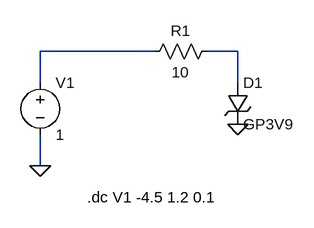
[diagram p0: schematic simulacion_zenner.asc]
simulacion_zenner.asc, the LTspice schematic file:
Version 4
SHEET 1 880 680
WIRE 144 64 -32 64
WIRE 272 64 224 64
WIRE -32 112 -32 64
WIRE 272 112 272 64
WIRE -32 240 -32 192
FLAG -32 240 0
FLAG 272 176 0
SYMBOL res 240 48 R90
WINDOW 0 0 56 VBottom 2
WINDOW 3 32 56 VTop 2
SYMATTR InstName R1
SYMATTR Value 10
SYMBOL voltage -32 96 R0
SYMATTR InstName V1
SYMATTR Value 1
SYMBOL zener 256 112 R0
SYMATTR InstName D1
SYMATTR Value GP3V9
TEXT 40 288 Left 2 !.dc V1 -4.5 1.2 0.1

The netlist it stands for:
* simulacion_zenner.asc
R1 N002 N001 10
V1 N001 0 1
D1 N002 0 GP3V9
.model D D
.lib standard.dio
.dc V1 -4.5 1.2 0.1
.backanno
.end